# EAGLE design MP3 Shield (EAGLE 6.5.0)
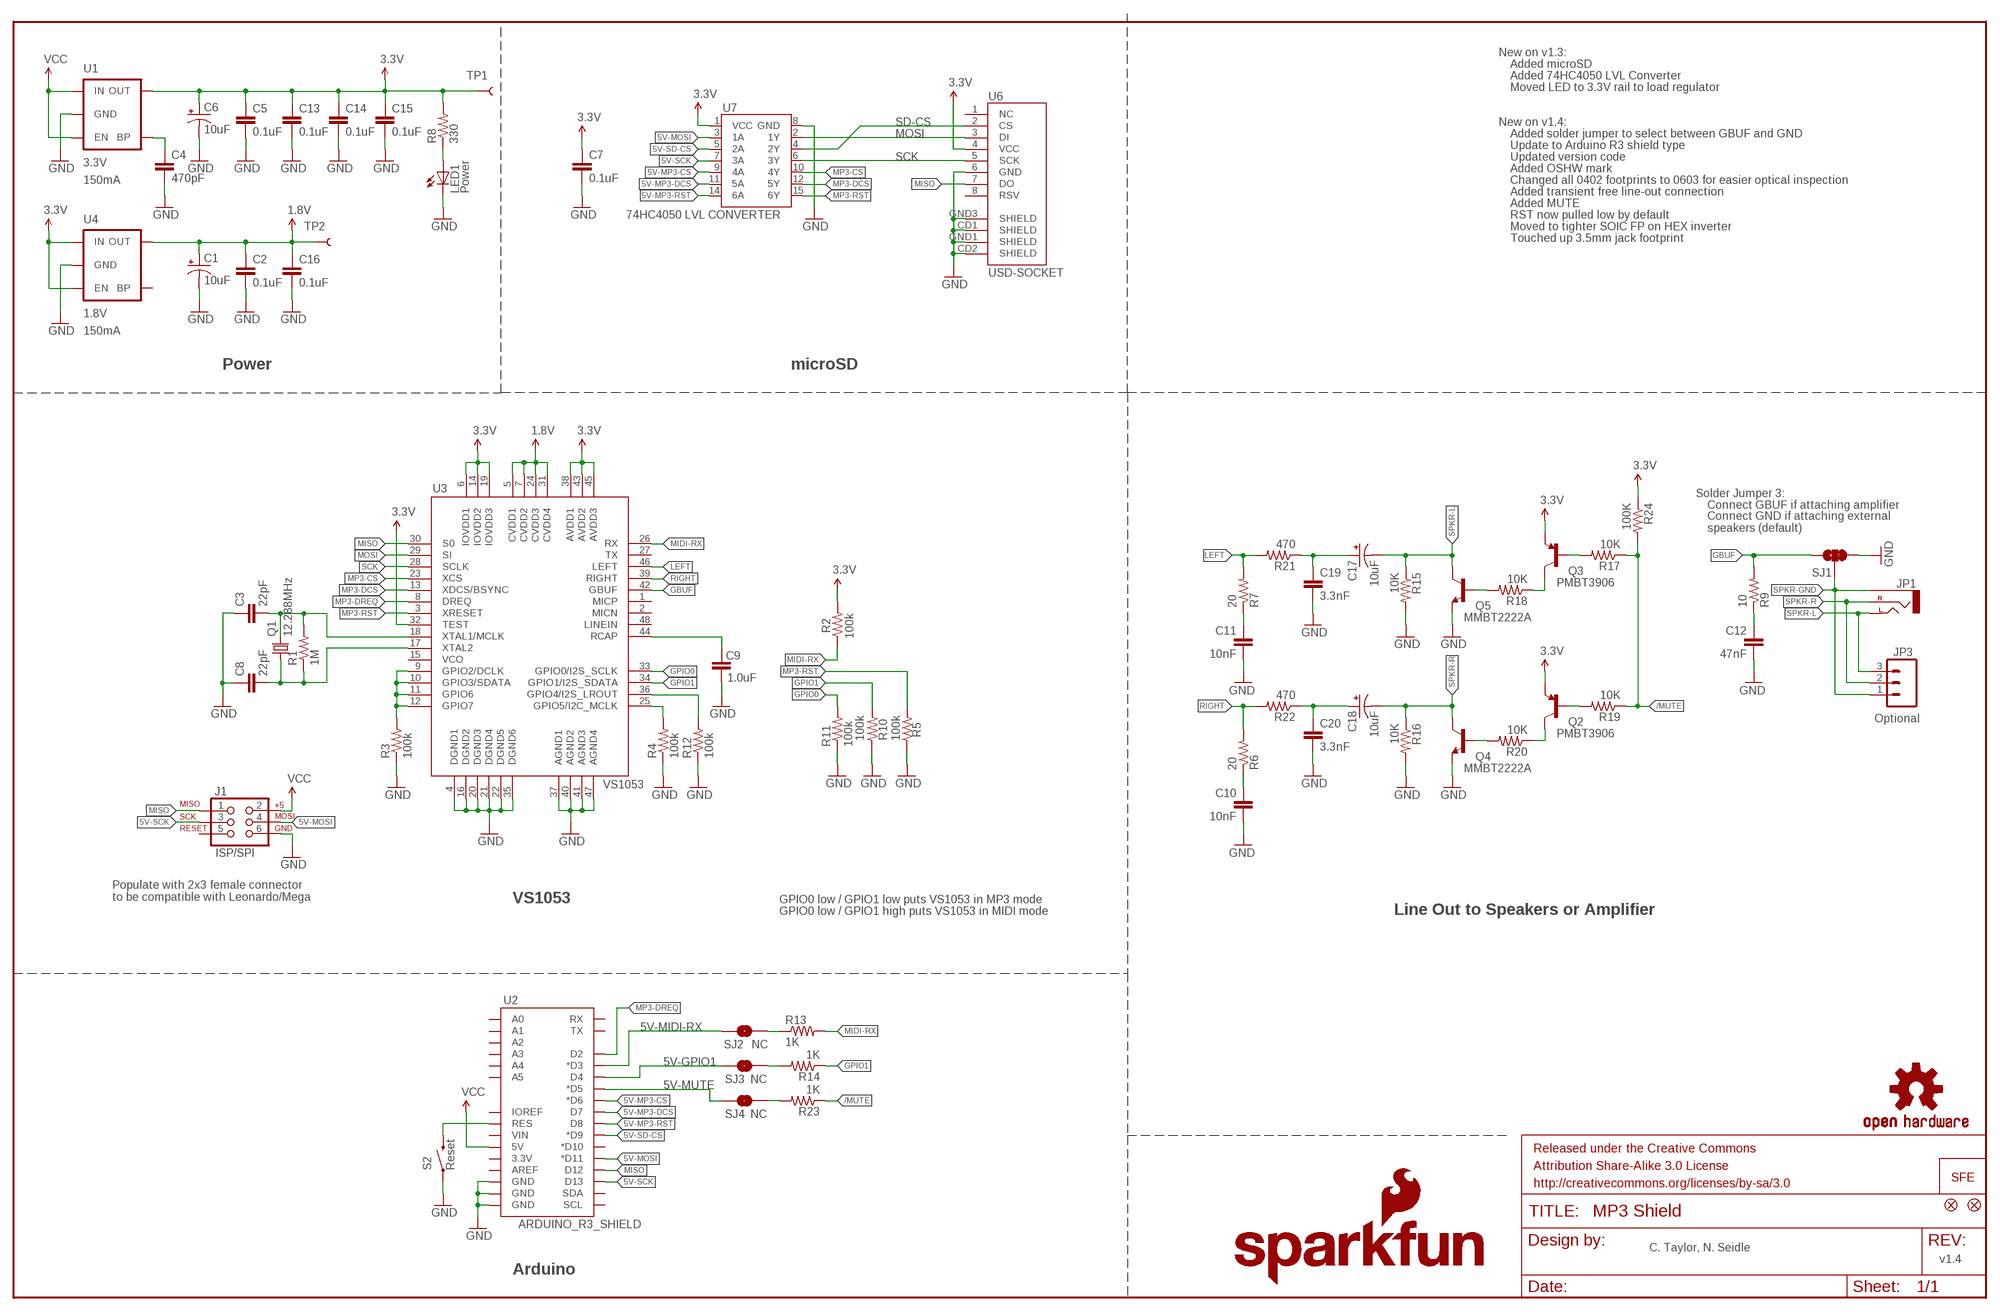
[diagram p0: schematic, sheet 1]

## Parts
C1  10uF  10UF-16V-10%(TANT)  [EIA3216]
C2  0.1uF  0.1UF-25V(+80/-20%)(0603)  [0603-CAP]
C3  22pF  22PF-50V-5%(0603)  [0603-CAP]
C4  470pF  470PF-50V-5%(0603)SMD  [0603-CAP]
C5  0.1uF  0.1UF-25V(+80/-20%)(0603)  [0603-CAP]
C6  10uF  10UF-16V-10%(TANT)  [EIA3216]
C7  0.1uF  0.1UF-25V(+80/-20%)(0603)  [0603-CAP]
C8  22pF  22PF-50V-5%(0603)  [0603-CAP]
C9  1.0uF  1.0UF-16V-10%(0603)  [0603-CAP]
C10  10nF  10NF/10000PF-50V-10%(0603)  [0603-CAP]
C11  10nF  10NF/10000PF-50V-10%(0603)  [0603-CAP]
C12  47nF  47NF(0.047UF/47000PF)-25V-5%(0603)SMD  [0603-CAP]
C13  0.1uF  0.1UF-25V(+80/-20%)(0603)  [0603-CAP]
C14  0.1uF  0.1UF-25V(+80/-20%)(0603)  [0603-CAP]
C15  0.1uF  0.1UF-25V(+80/-20%)(0603)  [0603-CAP]
C16  0.1uF  0.1UF-25V(+80/-20%)(0603)  [0603-CAP]
C17  10uF  10UF-16V-10%(TANT)  [EIA3216]
C18  10uF  10UF-16V-10%(TANT)  [EIA3216]
C19  3.3nF  3.3NF-100V-10%(0603)  [0603-CAP]
C20  3.3nF  3.3NF-100V-10%(0603)  [0603-CAP]
FRAME1  FRAME-LEDGER  [CREATIVE_COMMONS]
J1  ISP/SPI  AVR_SPI_PRG_6PTH  [2X3]
JP1  AUDIO-JACKSMD2  [AUDIO-JACK-3.5MM-SMD]
JP3  Optional  M03PTH  [1X03]
LED1  Power  LED-RED0603  [LED-0603]
LOGO1  OSHW-LOGOS  [OSHW-LOGO-S]
LOGO2  SFE_LOGO_NAME_FLAME.1_INCH  [SFE_LOGO_NAME_FLAME_.1]
Q1  12.288MHz  CRYSTAL5X3  [CRYSTAL-SMD-5X3]
Q2  PMBT3906  TRANSISTOR_PNPPMBT3906  [SOT23-3]
Q3  PMBT3906  TRANSISTOR_PNPPMBT3906  [SOT23-3]
Q4  MMBT2222A  TRANSISTOR_NPNMMBT2222A  [SOT23-3]
Q5  MMBT2222A  TRANSISTOR_NPNMMBT2222A  [SOT23-3]
R1  1M  1M-1%  [0603-RES]
R2  100k  100KOHM1/10W1%(0603)  [0603-RES]
R3  100k  100KOHM1/10W1%(0603)  [0603-RES]
R4  100k  100KOHM1/10W1%(0603)  [0603-RES]
R5  100k  100KOHM1/10W1%(0603)  [0603-RES]
R6  20  20OHM1/10W1%(0603)SMD  [0603-RES]
R7  20  20OHM1/10W1%(0603)SMD  [0603-RES]
R8  330  330OHM1/10W1%(0603)  [0603-RES]
R9  10  10OHM1/10W5%0603SMD  [0603-RES]
R10  100k  100KOHM1/10W1%(0603)  [0603-RES]
R11  100k  100KOHM1/10W1%(0603)  [0603-RES]
R12  100k  100KOHM1/10W1%(0603)  [0603-RES]
R13  1K  1KOHM1/10W1%(0603)  [0603-RES]
R14  1K  1KOHM1/10W1%(0603)  [0603-RES]
R15  10K  10KOHM1/10W1%(0603)0603  [0603-RES]
R16  10K  10KOHM1/10W1%(0603)0603  [0603-RES]
R17  10K  10KOHM1/10W1%(0603)0603  [0603-RES]
R18  10K  10KOHM1/10W1%(0603)0603  [0603-RES]
R19  10K  10KOHM1/10W1%(0603)0603  [0603-RES]
R20  10K  10KOHM1/10W1%(0603)0603  [0603-RES]
R21  470  470OHM1/10W1%(0603)  [0603-RES]
R22  470  470OHM1/10W1%(0603)  [0603-RES]
R23  1K  1KOHM1/10W1%(0603)  [0603-RES]
R24  100K  100KOHM1/10W1%(0603)  [0603-RES]
S2  Reset  SWITCH-MOMENTARY-2SMD  [TACTILE_SWITCH_SMD]
SJ1  SOLDERJUMPER_2WAYPASTE2&3  [SJ_3_PASTE2&3]
SJ2  NC  SOLDERJUMPERTRACE  [SJ_2S-TRACE]
SJ3  NC  SOLDERJUMPERTRACE  [SJ_2S-TRACE]
SJ4  NC  SOLDERJUMPERTRACE  [SJ_2S-TRACE]
TP1  TEST-POINT3X5  [PAD.03X.05]
TP2  TEST-POINT3X5  [PAD.03X.05]
U1  3.3V  V_REG_MIC52053.3V  [SOT23-5]
U2  ARDUINO_R3_SHIELD  [UNO_R3_SHIELD]
U3  VS1053  VS1033/1053SMD  [LQFP-48]
U4  1.8V  V_REG_SP62141.8V  [SC70]
U6  USD-SOCKET  USD-SOCKETNEW  [MICRO-SD-SOCKET-PP]
U7  74HC4050 LVL CONVERTER  HEX_CONVERTER  [SO016]
U$4  FIDUCIAL1X2  [FIDUCIAL-1X2]
U$5  FIDUCIAL1X2  [FIDUCIAL-1X2]
U$8  LOGO-SFENEW  [SFE-NEW-WEBLOGO]

## Nets
1.8V: C1.A(+) C2.1 C16.1 TP2.P$1 U3.5(CVDD1) U3.7(CVDD2) U3.24(CVDD3) U3.31(CVDD4) U4.5(OUT)
3.3V: C5.1 C6.A(+) C7.1 C13.1 C14.1 C15.1 Q2.2(E) Q3.2(E) R2.2 R8.2 R24.1 TP1.P$1 U1.5(OUT) U3.6(IOVDD1) U3.14(IOVDD2) U3.19(IOVDD3) U3.32(TEST) U3.38(AVDD1) U3.43(AVDD2) U3.45(AVDD3) U4.1(IN) U4.3(EN) U6.4(VCC) U7.1(VCC)
5V-GPIO1: SJ3.2 U2.D4
5V-MIDI-RX: SJ2.1 U2.D3(*D3)
5V-MOSI: J1.4 U2.D11(*D11) U7.3(1A)
5V-MP3-CS: U2.D6(*D6) U7.9(4A)
5V-MP3-DCS: U2.D7 U7.11(5A)
5V-MP3-RST: U2.D8 U7.14(6A)
5V-MUTE: SJ4.2 U2.D5(*D5)
5V-SCK: J1.3 U2.D13 U7.7(3A)
5V-SD-CS: U2.D9(*D9) U7.5(2A)
/MUTE: R17.1 R19.1 R23.1 R24.2
ARST: S2.3 U2.RES
G1: R3.2 U3.9(GPIO2/DCLK) U3.10(GPIO3/SDATA) U3.11(GPIO6) U3.12(GPIO7)
G2: R4.2 U3.25(GPIO5/I2C_MCLK)
GBUF: R9.2 SJ1.1 U3.42(GBUF)
GND: C1.C(-) C2.2 C3.1 C4.2 C5.2 C6.C(-) C7.2 C8.1 C9.1 C10.2 C11.2 C12.2 C13.2 C14.2 C15.2 C16.2 C19.2 C20.2 J1.6 LED1.C Q4.2(E) Q5.2(E) R3.1 R4.1 R5.1 R10.1 R11.1 R12.1 R15.2 R16.2 S2.1 SJ1.3 U1.2(GND) U2.GND@0(GND) U2.GND@1(GND) U2.GND@2(GND) U3.4(DGND1) U3.16(DGND2) U3.20(DGND3) U3.21(DGND4) U3.22(DGND5) U3.35(DGND6) U3.37(AGND1) U3.40(AGND2) U3.41(AGND3) U3.47(AGND4) U4.2(GND) U6.6(GND) U6.CD1(SHIELD) U6.CD2(SHIELD) U6.GND1(SHIELD) U6.GND3(SHIELD) U7.8(GND)
GPIO0: R11.2 U3.33(GPIO0/I2S_SCLK)
GPIO1: R10.2 R14.1 U3.34(GPIO1/I2S_SDATA)
GPIO4: R12.2 U3.36(GPIO4/I2S_LROUT)
LEFT: R7.2 R21.2 U3.46(LEFT)
MIDI-RX: R2.1 R13.2 U3.26(RX)
MISO: J1.1 U2.D12 U3.30(S0) U6.7(DO)
MOSI: U3.29(SI) U6.3(DI) U7.2(1Y)
MP3-CS: U3.23(XCS) U7.10(4Y)
MP3-DCS: U3.13(XDCS/BSYNC) U7.12(5Y)
MP3-DREQ: U2.D2 U3.8(DREQ)
MP3-RST: R5.2 U3.3(XRESET) U7.15(6Y)
N$1: Q4.1(B) R20.2
N$2: C12.1 R9.1
N$3: C10.1 R6.1
N$4: R14.2 SJ3.1
N$5: C11.1 R7.1
N$6: LED1.A R8.1
N$7: Q2.3(C) R20.1
N$8: R13.1 SJ2.2
N$9: C3.2 Q1.3 R1.2 U3.18(XTAL1/MCLK)
N$10: C8.2 Q1.1 R1.1 U3.17(XTAL2)
N$11: Q2.1(B) R19.2
N$12: Q5.1(B) R18.2
N$14: R23.2 SJ4.1
N$15: Q3.3(C) R18.1
N$16: Q3.1(B) R17.2
N$17: C18.A(+) C20.1 R22.1
N$19: C17.A(+) C19.1 R21.1
N$70: C4.1 U1.4(BP)
RCAP: C9.2 U3.44(RCAP)
RIGHT: R6.2 R22.2 U3.39(RIGHT)
SCK: U3.28(SCLK) U6.5(SCK) U7.6(3Y)
SD-CS: U6.2(CS) U7.4(2Y)
SPKR-GND: JP1.SLEEVE JP3.1 SJ1.2
SPKR-L: C17.C(-) JP1.TIP(LEFT) JP3.3 Q5.3(C) R15.1
SPKR-R: C18.C(-) JP1.RING(RIGHT) JP3.2 Q4.3(C) R16.1
VCC: J1.2 U1.1(IN) U1.3(EN) U2.5V
Unconnected: J1.5 U2.3.3V U2.A0 U2.A1 U2.A2 U2.A3 U2.A4 U2.A5 U2.AREF U2.D10(*D10) U2.IOREF U2.RX U2.SCL U2.SDA U2.TX U2.VIN U3.1(MICP) U3.2(MICN) U3.15(VCO) U3.27(TX) U3.48(LINEIN) U4.4(BP) U6.1(NC) U6.8(RSV)

## Notes on the sheet
- New on v1.3:
- Added microSD
- Added 74HC4050 LVL Converter
- Moved LED to 3.3V rail to load regulator
- New on v1.4:
- Added solder jumper to select between GBUF and GND
- Update to Arduino R3 shield type
- Updated version code
- Added OSHW mark
- 150mA | Changed all 0402 footprints to 0603 for easier optical inspection
- Added transient free line-out connection
- Added MUTE
- RST now pulled low by default
- Moved to tighter SOIC FP on HEX inverter
- Touched up 3.5mm jack footprint
- 150mA
- Power | microSD
- Solder Jumper 3:
- Connect GBUF if attaching amplifier
- Connect GND if attaching external
  speakers (default)
- Populate with 2x3 female connector 
  to be compatible with Leonardo/Mega
- VS1053 | GPIO0 low / GPIO1 low puts VS1053 in MP3 mode
- GPIO0 low / GPIO1 high puts VS1053 in MIDI mode | Line Out to Speakers or Amplifier
- C. Taylor, N. Seidle
- v1.4
- Arduino

## Library data of the parts
C1 C6 C17 C18 = SparkFun-Capacitors:10UF-16V-10%(TANT): CAP-00811 1206/EIA-3216 Tantalum capacitor; PROD_ID: CAP-00811
C2 C5 C7 C13-C16 = SparkFun-Capacitors:0.1UF-25V(+80/-20%)(0603): CAP-00810 Ceramic Standard decoupling cap; PROD_ID: CAP-00810
C3 C8 = SparkFun-Capacitors:22PF-50V-5%(0603): CAP-07876; PROD_ID: CAP-07876
C4 = SparkFun-Capacitors:470PF-50V-5%(0603): CAP-07884; PROD_ID: CAP-07884
C9 = SparkFun-Capacitors:1.0UF-16V-10%(0603): CAP-00868; PROD_ID: CAP-00868
C10 C11 = SparkFun-Capacitors:10NF/10000PF-50V-10%(0603): CAP-00867; PROD_ID: CAP-00867
C12 = SparkFun-Capacitors:47NF(0.047UF/47000PF)-25V-5%(0603): CAP-08605; PROD_ID: CAP-08605
C19 C20 = SparkFun-Capacitors:3.3NF-100V-10%(0603): CAP-09633; PROD_ID: CAP-09633
FRAME1 = SparkFun-Aesthetics:FRAME-LEDGER: Schematic Frame Standard 11x14 US Ledger frame
J1 = SparkFun:AVR_SPI_PRG_6: AVR ISP 6 Pin This is the reduced ISP connector for AVR programming. Common on Arduino. This footprint will take up less PCB space and can be used with a 10-pin to 6-pin adapter such as SKU: BOB-08508
JP1 = SparkFun-Connectors:AUDIO-JACK: 3.5mm Audio Jack Simple 3.5mm common PCB mount audio jack. SKU: PRT-08032; PROD_ID: CONN-10353
JP3 = SparkFun:M03: Header 3 Standard 3-pin 0.1" header. Use with straight break away headers (SKU : PRT-00116), right angle break away headers (PRT-00553), swiss pins (PRT-00743), machine pins (PRT-00117), and female headers (PRT-00115). Molex polarized connector foot print use with SKU : PRT-08232 with associated crimp pins and housings.
LED1 = SparkFun-LED:LED-RED: Assorted Red LEDs LilyPad 1206- DIO-09912 1206- DIO-00809 0603- DIO-00819; PROD_ID: DIO-00819; VALUE: RED
LOGO1 = SparkFun-Aesthetics:OSHW-LOGO: Open Source Hardware Logo This logo indicates the piece of hardware it is found on incorporates a OSHW license and/or adheres to the definition of open source hardware found here: http://freedomdefined.org/OSHW
LOGO2 = SparkFun-Aesthetics:SFE_LOGO_NAME_FLAME: SFE Logo, name and flame This is the SparkFun full logo. The logo on the schematic will always be the same size; the package variant is the height of the flame part of the logo. Default layer for the logo on the board is tSilk.
Q1 = SparkFun:CRYSTAL: Crystals Various standard crystals. Proven footprints. Spark Fun Electronics SKU : COM-00534
Q2 Q3 = SparkFun-DiscreteSemi:TRANSISTOR_PNP: Generic PNP BJT Double check pinouts against datasheets- not all devices are the same! MMBT3906 - 40V 200mA SOT-23 (TRANS-08052) MMBT4403 - 40V 600mA SOT-23 (TRANS-09245); PROD_ID: TRANS-08052
Q4 Q5 = SparkFun-DiscreteSemi:TRANSISTOR_NPN: Generic NPN BJT MMBT2222A - TRANS-08049 (SOT-23, 1A 40V) MPSA42 - TRANS-09116 (SOT-23, 500mA 300V) MMBT5088LT1G - TRANS-11160 (SOT-23, 50 mA 30V); PROD_ID: TRANS-08049
R1 = SparkFun-Resistors:1M-1%: 1M-ohm SMT 1/10W - 1% (0603) RES-07868; PROD_ID: RES-07868
R2-R5 R10-R12 = SparkFun-Resistors:100KOHM1/10W1%(0603): RES-07828; PROD_ID: RES-07828
R6 R7 = SparkFun-Resistors:20OHM1/10W1%(0603): RES-07862; PROD_ID: RES-07862
R8 = SparkFun-Resistors:330OHM1/10W1%(0603): RES-00818; PROD_ID: RES-00818
R9 = SparkFun-Resistors:10OHM1/10W5%0603: RES-09834; PROD_ID: RES-09834
R13 R14 R23 = SparkFun-Resistors:1KOHM1/10W1%(0603): RES-07856; PROD_ID: RES-07856
R15-R20 = SparkFun-Resistors:10KOHM1/10W1%(0603): RES-00824; PROD_ID: RES-00824
R21 R22 = SparkFun-Resistors:470OHM1/10W1%(0603): RES-07869; PROD_ID: RES-07869
R24 = SparkFun-Resistors:100KOHM1/10W1%(0603): RES-07828; PROD_ID: RES-07828; VALUE: 100k
S2 = SparkFun-Electromechanical:SWITCH-MOMENTARY-2: Various NO switches- pushbuttons, reed, etc; PROD_ID: SWCH-08247
SJ1 = SparkFun-Passives:SOLDERJUMPER_2WAY: Solder Jumper 2 way solder jumper
SJ2-SJ4 = SparkFun:SOLDERJUMPER: Solder Jumper Standard SMD solder jumper. Used to automate production. Two varients : Normally Open and Normally Closed are the same, but have different paste layers. NC will have a large amount of paste and should jumper during reflow.
TP1 TP2 = SparkFun:TEST-POINT
U1 = SparkFun-PowerIC:V_REG_MIC5205: V_REG MIC5219 Standard 3.3V and 5V 150mA LDO voltage regulator in SOT-23 layout. Micrel part MIC5205. BP (by-pass) pin is used to lower output noise with 470pF cap, may be left open.; PROD_ID: VREG-00822; VALUE: 3.3V/150mA
U2 = SparkFun-Boards:ARDUINO_R3_SHIELD: Shield form compatible with the Arduino Uno R3.
U3 = SparkFun-DigitalIC:VS1033/1053: MP3 codec; PROD_ID: IC-08983; VALUE: VS1053B
U4 = SparkFun-PowerIC:V_REG_SP6214; PROD_ID: VREG-08428; VALUE: 1.8V/100mA
U6 = SparkFun:USD-SOCKET: microSD Socket Push-push type uSD socket. Schematic element and footprint production proven. Spark Fun Electronics SKU : PRT-00127. tDoc lines correctly indicate media card edge positions when inserting (unlocked, locked, depressed).
U7 = SparkFun-DigitalIC:HEX_CONVERTER: Just what it says.
U$4 U$5 = SparkFun:FIDUCIAL: Fiducial Alignment Points Various fiducial points for machine vision alignment.
U$8 = SparkFun:LOGO-SFE: Spark Fun Electronics PCB Logo This is the standard Spark Fun Electronics PCB logo.

## Board
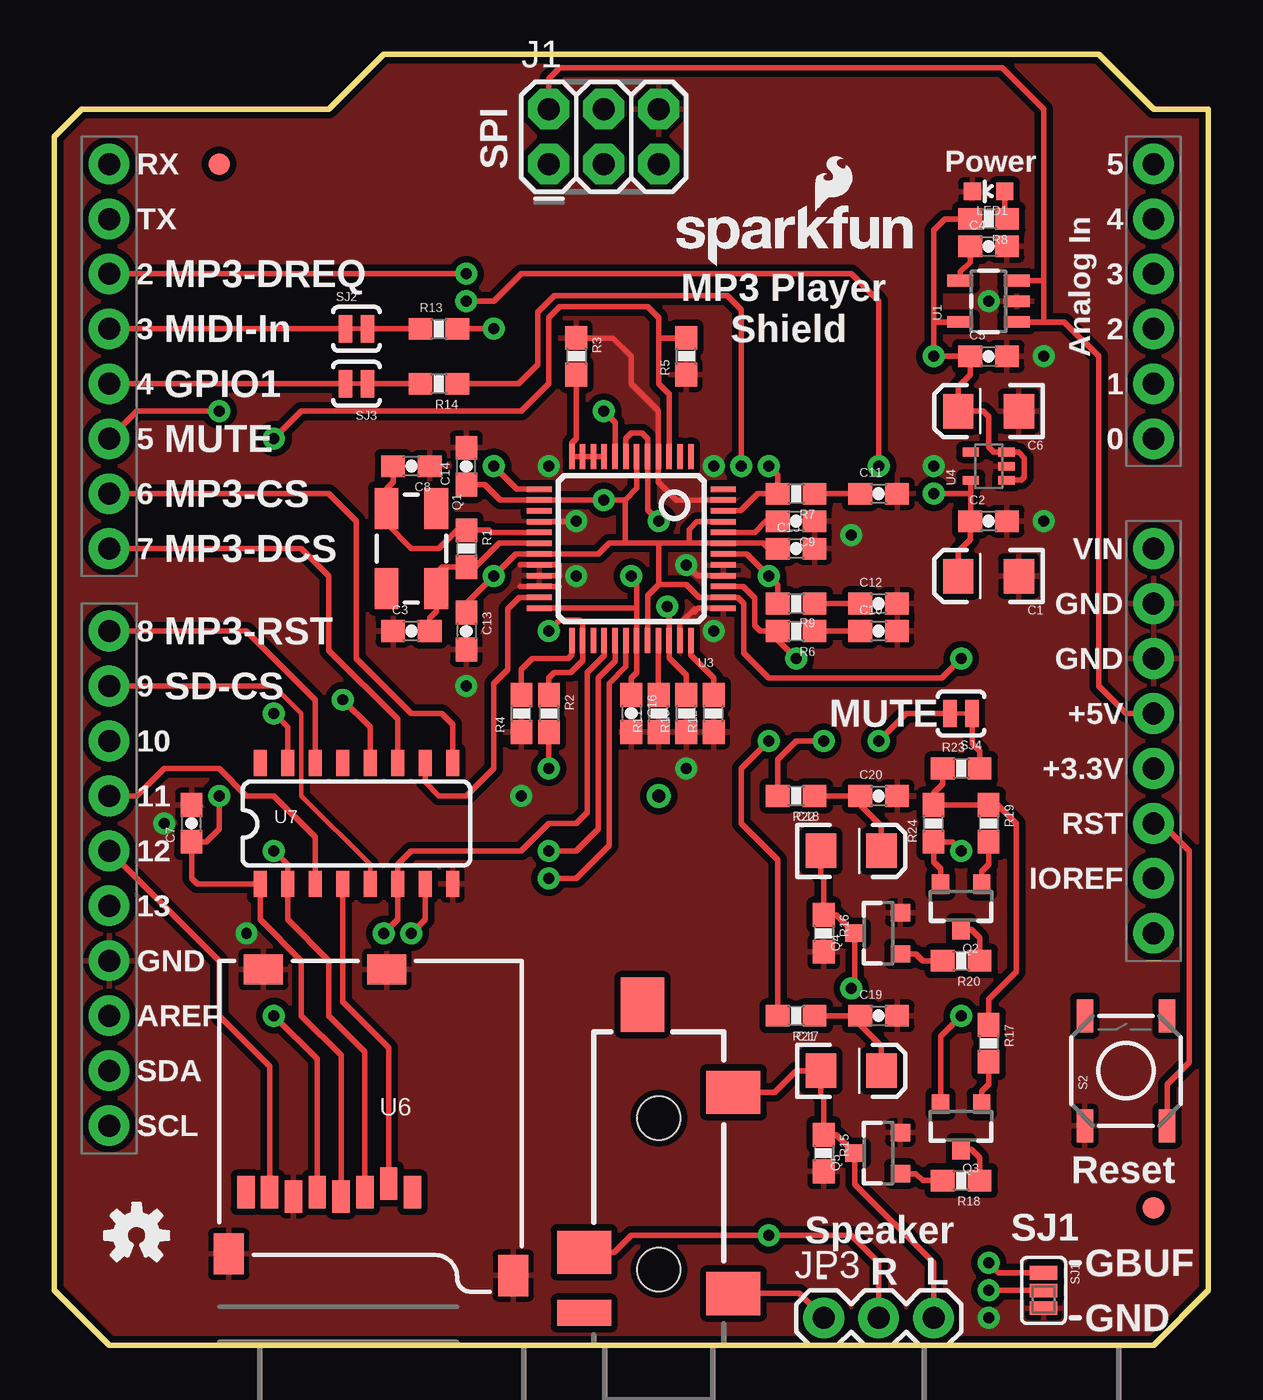
[diagram p1: board, top side]
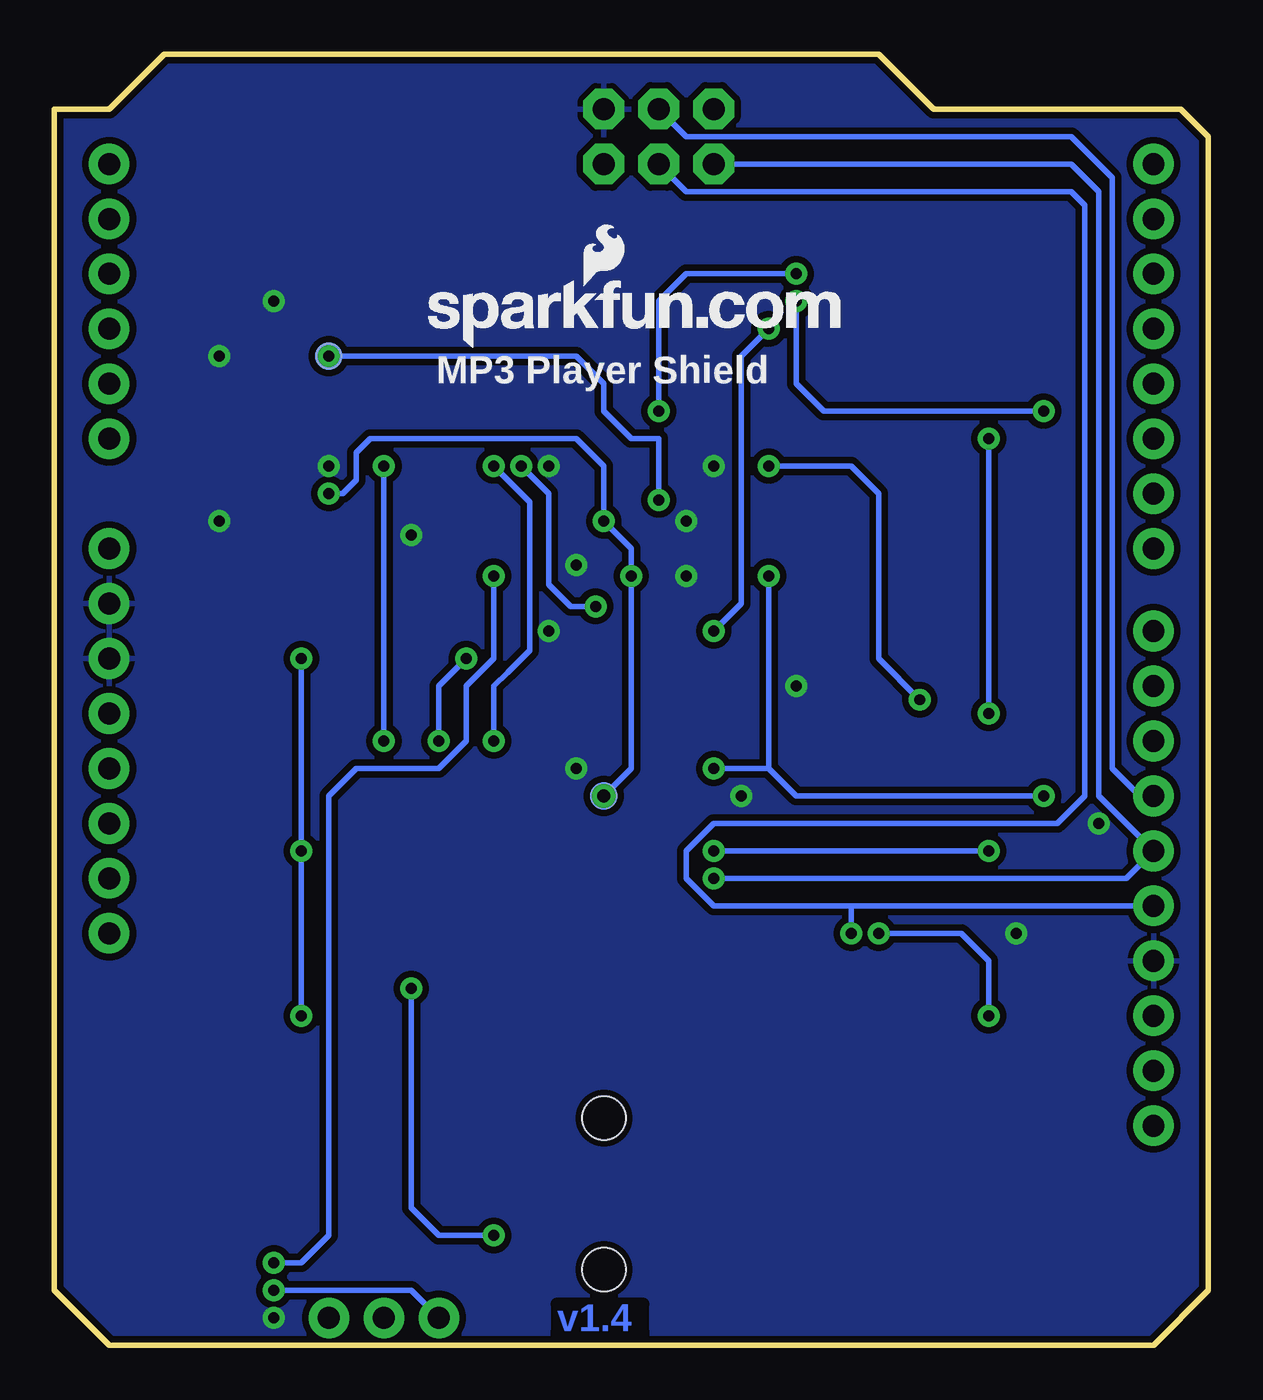
[diagram p2: board, bottom side, seen from below]

Size 53.34 x 59.69 mm. Coordinates in mm from the lower left corner, seen from the top.
Outline: 2.54,0 0,2.54 0,55.88 1.27,57.15 12.7,57.15 15.24,59.69 48.26,59.69 50.8,57.15 53.34,57.15 53.34,2.54 50.8,0 2.54,0
Copper layers (1*16): Top 0.035mm / dielectric 1.5mm / Bottom 0.035mm
Design rules "SparkFun *": minimum track width 8mil, minimum drill 20mil, track to track 8mil, track to pad 8mil, pad to pad 8mil, via to via 8mil, smd to smd 8mil, copper to edge 10mil, drill to drill 8mil, minimum pad ring 12mil, minimum via ring 10mil, stop-mask expansion 4mil, vias tented up to drill 20mil, thermal gap 10mil

### Footprints (pad centres in the part's own frame; a part is rotated, then mirrored left to right if it is on the bottom)
EIA3216 = smd 1.4 x 1.6: A 1.4,0; C -1.4,0
0603-CAP = smd 1.1 x 1: 1 -0.85,0; 2 0.85,0
2X3 = drill 1.016 pad 1.88 octagon: 1 0,0; 2 0,2.54; 3 2.54,0; 4 2.54,2.54; 5 5.08,0; 6 5.08,2.54
AUDIO-JACK-3.5MM-SMD = smd 2 x 2.5: RING 4.3,3.45; SLEEVE 2.4,-3.45; TIP 11.7,-3.45 | smd 1.2 x 2.5: RSH 1.5,3.45 | smd 2.5 x 2: TSH 15.75,0.75 | hole 2: 3.5,0; 10.5,0
1X03 = drill 1.016 pad 1.88: 1 0,0; 2 2.54,0; 3 5.08,0
LED-0603 = smd 0.8 x 0.8: A 0,-0.75; C 0,0.75
CRYSTAL-SMD-5X3 = smd 1.9 x 1.1: 1 -1.85,-1.15; 2 1.85,-1.15; 3 1.85,1.15; 4 -1.85,1.15
SOT23-3 = smd 0.8 x 0.9: 1 -0.95,-1; 2 0.95,-1; 3 0,1.1
0603-RES = smd 1.1 x 1: 1 -0.85,0; 2 0.85,0
TACTILE_SWITCH_SMD = smd 1.524 x 0.762: 1 -2.54,1.905; 2 2.54,1.905; 3 -2.54,-1.905; 4 2.54,-1.905
SJ_3_PASTE2&3 = smd 0.635 x 1.27: 1 -0.813,0; 2 0,0; 3 0.813,0
SJ_2S-TRACE = smd 0.635 x 1.27: 1 -0.508,0; 2 0.508,0
PAD.03X.05 = smd 1.27 x 1.27: P$1 0,0
SOT23-5 = smd 0.55 x 1.2: 1 -0.95,-1.3; 2 0,-1.3; 3 0.95,-1.3; 4 0.95,1.3; 5 -0.95,1.3
UNO_R3_SHIELD = drill 1.016 pad 1.88: 3.3V 50.8,26.67; 5V 50.8,29.21; A0 50.8,41.91; A1 50.8,44.45; A2 50.8,46.99; A3 50.8,49.53; A4 50.8,52.07; A5 50.8,54.61; AREF 2.54,15.24; D2 2.54,49.53; D3 2.54,46.99; D4 2.54,44.45; D5 2.54,41.91; D6 2.54,39.37; D7 2.54,36.83; D8 2.54,33.02; D9 2.54,30.48; D10 2.54,27.94; D11 2.54,25.4; D12 2.54,22.86; D13 2.54,20.32; GND@0 50.8,31.75; GND@1 50.8,34.29; GND@2 2.54,17.78; IOREF 50.8,21.59; NC 50.8,19.05; RES 50.8,24.13; RX 2.54,54.61; SCL 2.54,10.16; SDA 2.54,12.7; TX 2.54,52.07; VIN 50.8,36.83
LQFP-48 = smd 0.254 x 1.143: 1 -2.75,-4.25; 2 -2.25,-4.25; 3 -1.75,-4.25; 4 -1.25,-4.25; 5 -0.75,-4.25; 6 -0.25,-4.25; 7 0.25,-4.25; 8 0.75,-4.25; 9 1.25,-4.25; 10 1.75,-4.25; 11 2.25,-4.25; 12 2.75,-4.25; 25 2.75,4.25; 26 2.25,4.25; 27 1.75,4.25; 28 1.25,4.25; 29 0.75,4.25; 30 0.25,4.25; 31 -0.25,4.25; 32 -0.75,4.25; 33 -1.25,4.25; 34 -1.75,4.25; 35 -2.25,4.25; 36 -2.75,4.25 | smd 1.143 x 0.254: 13 4.25,-2.75; 14 4.25,-2.25; 15 4.25,-1.75; 16 4.25,-1.25; 17 4.25,-0.75; 18 4.25,-0.25; 19 4.25,0.25; 20 4.25,0.75; 21 4.25,1.25; 22 4.25,1.75; 23 4.25,2.25; 24 4.25,2.75; 37 -4.25,2.75; 38 -4.25,2.25; 39 -4.25,1.75; 40 -4.25,1.25; 41 -4.25,0.75; 42 -4.25,0.25; 43 -4.25,-0.25; 44 -4.25,-0.75; 45 -4.25,-1.25; 46 -4.25,-1.75; 47 -4.25,-2.25; 48 -4.25,-2.75
SC70 = smd 0.4 x 0.75: 1 -0.65,-0.825; 2 0,-0.825; 3 0.65,-0.825; 4 0.65,0.825; 5 -0.65,0.825
MICRO-SD-SOCKET-PP = smd 0.8 x 1.5: 1 -8.94,10.7; 2 -7.84,10.3; 3 -6.74,10.7; 4 -5.64,10.9; 5 -4.54,10.7; 6 -3.44,10.9; 7 -2.34,10.7; 8 -1.24,10.7 | smd 1.8 x 1.4: CD1 -2.05,0.4; CD2 -7.75,0.4 | smd 1.4 x 1.9: GND1 -13.6,14.55; GND3 -0.45,13.55
SO016 = smd 0.6 x 1.2: 1 -4.445,-2.8; 2 -3.175,-2.8; 3 -1.905,-2.8; 4 -0.635,-2.8; 5 0.635,-2.8; 6 1.905,-2.8; 7 3.175,-2.8; 8 4.445,-2.8; 9 4.445,2.8; 10 3.175,2.8; 11 1.905,2.8; 12 0.635,2.8; 13 -0.635,2.8; 14 -1.905,2.8; 15 -3.175,2.8; 16 -4.445,2.8
FIDUCIAL-1X2 = smd 1 x 1: 1 0,0

### Placement (x,y rotation side)
C1  43.18,35.56 180 top
C2  43.18,38.1 0 top
C3  16.51,33.02 0 top
C4  43.18,50.8 0 top
C5  43.18,45.72 0 top
C6  43.18,43.18 180 top
C7  6.35,24.13 90 top
C8  16.51,40.64 180 top
C9  34.29,38.1 180 top
C10  38.1,33.02 0 top
C11  38.1,39.37 0 top
C12  38.1,34.29 0 top
C13  19.05,33.02 270 top
C14  19.05,40.64 90 top
C15  34.29,36.83 0 top
C16  26.67,29.21 270 top
C17  36.83,12.7 0 top
C18  36.83,22.86 0 top
C19  38.1,15.24 0 top
C20  38.1,25.4 0 top
FRAME1  -19.05,-24.13 0 top  (outside the outline)
J1  22.86,54.61 0 top
JP1  27.94,0 90 top
JP3  35.56,1.27 0 top
LED1  43.18,53.34 90 top
LOGO1  3.81,5.08 0 top
LOGO2  28.32,49.78 0 top
Q1  16.51,36.83 270 top
Q2  41.91,20.32 180 top
Q3  41.91,10.16 180 top
Q4  38.1,19.05 90 top
Q5  38.1,8.89 90 top
R1  19.05,36.83 270 top
R2  22.86,29.21 270 top
R3  24.13,45.72 270 top
R4  21.59,29.21 90 top
R5  29.21,45.72 90 top
R6  34.29,33.02 180 top
R7  34.29,39.37 180 top
R8  43.18,52.07 180 top
R9  34.29,34.29 180 top
R10  29.21,29.21 90 top
R11  27.94,29.21 90 top
R12  30.48,29.21 90 top
R13  17.78,46.99 0 top
R14  17.78,44.45 180 top
R15  35.56,8.89 270 top
R16  35.56,19.05 270 top
R17  43.18,13.97 270 top
R18  41.91,7.62 180 top
R19  43.18,24.13 270 top
R20  41.91,17.78 180 top
R21  34.29,15.24 180 top
R22  34.29,25.4 180 top
R23  41.91,26.67 0 top
R24  40.64,24.13 90 top
S2  49.53,12.7 90 top
SJ1  45.72,2.54 270 top
SJ2  13.97,46.99 0 top
SJ3  13.97,44.45 180 top
SJ4  41.91,29.21 180 top
TP1  40.64,45.72 0 bottom
TP2  27.94,25.4 0 bottom
U1  43.18,48.26 90 top
U2  0,0 0 top
U3  26.67,36.83 180 top
U4  43.18,40.64 90 top
U6  7.62,17.78 180 top
U7  13.97,24.13 0 top
U$4  7.62,54.61 0 top
U$5  50.8,6.35 0 top
U$8  36.07,46.1 0 bottom

### Tracks (layer width: path | path; a pad name or v marks a point on that pad's centre or on a via)
1.8V  (via drill 0.51, 0.6)
  Top 0.254: 26.92,34.04 U3.31 26.92,31.11 26.67,30.86 C16.1 | 26.92,34.04 26.92,35.31 v26.67,35.56 | U3.24 26.88,34.08 26.92,34.04 | v27.94,38.1 27.42,38.62 U3.5 27.42,41.92 27.18,42.16 26.67,42.16 26.42,41.91 U3.7 | C1.A 41.78,36.7 42.33,37.25 C2.1 42.35,38.12 42.35,39.37 | U4.5 42.35,39.37 | 42.35,39.37 v40.64,39.37
  Bottom 0.254: TP2.P$1 26.67,26.67 v26.67,35.56 26.67,36.83 v27.94,38.1 27.94,40.64 29.21,41.91 38.73,41.91 39.37,41.27 39.37,40.01 40.01,39.37 v40.64,39.37
  other vias: 27.94,25.4
3.3V  (via drill 0.51)
  Top 0.254: 26.42,37.08 25.65,37.08 25.15,36.58 U3.19 21.34,36.58 v20.32,35.56 19.05,34.29 C13.1 | 26.42,37.08 27.94,37.08 | 27.94,37.08 29.34,37.08 | 29.34,37.08 U3.43 32.77,37.08 33.02,36.83 C15.1 | U3.45 29.7,38.08 29.34,37.72 29.34,37.08 | 26.42,37.08 26.38,37.12 26.38,39.08 | 26.38,39.08 v25.4,39.08 U3.14 20.61,39.08 19.9,39.79 C14.1 | U3.32 27.42,34.66 27.94,35.18 | 27.94,37.08 27.94,35.18 | U3.6 26.92,39.62 26.38,39.08 | U4.1 44.69,39.99 44.83,40.13 44.83,41.02 44.56,41.29 U4.3 43.42,41.29 43.18,41.53 43.18,42.93 42.93,43.18 C6.A 41.78,44.32 42.33,44.87 C5.1 TP1.P$1 40.64,47.37 | U6.4 13.26,13.41 11.43,15.24 11.43,17.78 9.53,19.68 U7.1 6.61,21.33 6.35,21.59 C7.1 7.02,23.28 7.62,23.88 v7.62,25.4 | U1.5 40.7,47.31 40.64,47.37 | 40.64,47.37 40.64,51.56 41.15,52.07 R8.2 | Q2.2 40.96,22.03 40.64,22.35 R24.1 41.49,23.28 v41.91,22.86 | Q3.2 40.96,14.29 v41.91,15.24 | R2.2 v22.86,26.67 | 27.94,35.18 29.21,35.18 29.81,34.58 U3.38 31.59,34.58 31.88,34.29 31.88,32 33.02,30.86 41.02,30.86 v41.91,31.75
  Bottom 0.254: 20.32,26.67 v20.32,35.56 | 20.32,26.67 v22.86,26.67 | v41.91,15.24 v41.91,22.86 v41.91,31.75 | TP1.P$1 29.21,45.72 27.94,44.45 27.94,43.18 26.67,41.91 25.4,41.91 v25.4,39.08 | v7.62,25.4 19.05,25.4 20.32,26.67
  other vias: 40.64,45.72
5V-GPIO1
  Top 0.254: SJ3.2 U2.D4
5V-MIDI-RX
  Top 0.254: SJ2.1 U2.D3
5V-MOSI
  Top 0.254: U7.3 12.06,23.5 10.16,25.4 8.89,25.4 7.62,26.67 5.08,26.67 3.81,25.4 U2.D11
  Bottom 0.254: U2.D11 3.17,25.4 4.45,26.67 4.45,53.98 6.35,55.88 24.13,55.88 J1.4
5V-MP3-CS
  Top 0.254: U2.D6 12.7,39.37 13.97,38.1 13.97,31.75 16.51,29.21 17.91,29.21 18.41,28.7 U7.9
5V-MP3-DCS
  Top 0.254: U7.11 15.88,28.96 12.7,32.13 12.7,35.56 11.43,36.83 U2.D7
5V-MP3-RST
  Top 0.254: U7.14 12.06,29.84 8.89,33.02 U2.D8
5V-MUTE  (via drill 0.51)
  Top 0.254: v19.05,48.26 20.32,48.26 21.59,49.53 36.83,49.53 38.1,48.26 v38.1,40.64 | U2.D5 3.81,43.18 v7.62,43.18 | v38.1,27.94 39.37,29.21 SJ4.2
  Bottom 0.254: v19.05,48.26 19.05,44.45 17.78,43.18 v7.62,43.18 | v38.1,40.64 v38.1,27.94
5V-SCK  (via drill 0.51)
  Top 0.254: U7.7 17.14,19.68 v16.51,19.05
  Bottom 0.254: 3.81,20.32 U2.D13 16.51,20.32 | 16.51,20.32 22.86,20.32 24.13,21.59 24.13,22.86 22.86,24.13 6.99,24.13 5.71,25.4 5.71,52.7 6.35,53.34 24.13,53.34 J1.3 | v16.51,19.05 16.51,20.32
5V-SD-CS
  Top 0.203: 10.16,30.48 11.43,29.21 11.43,25.4 14.61,22.23 U7.5
  Top 0.254: 10.16,30.48 U2.D9
/MUTE
  Top 0.254: R17.1 43.18,16 44.45,17.27 44.45,24.13 43.6,24.98 R19.1 R24.2 40.64,25.53 41.06,25.95 R23.1
ARST
  Top 0.254: U2.RES 51.18,24.13 52.45,22.86 52.45,13.08 51.44,12.06 S2.3
G1
  Top 0.254: U3.9 U3.10 U3.11 U3.12 23.92,41.7 24.13,41.91 R3.2
G2
  Top 0.254: U3.25 23.92,31.92 23.75,31.75 22.1,31.75 21.59,31.24 R4.2
GBUF  (via drill 0.51)
  Top 0.254: SJ1.1 43.64,3.35 v43.18,3.81 | R9.2 33.44,35.14 v33.02,35.56 32,36.58 U3.42
  Bottom 0.254: v33.02,35.56 33.02,31.75 34.29,30.48 34.29,27.94 35.56,26.67 39.37,26.67 40.64,25.4 40.64,5.08 41.91,3.81 v43.18,3.81
GND  (via drill 0.51)
  Top 0.254: U3.47 28.74,39.08 27.92,39.9 U3.4 27.92,43.2 26.67,44.45 26.67,45.72 25.82,46.57 R3.1 | U3.16 24.11,38.08 v24.13,38.1 | U3.21 23.35,35.58 | 23.35,35.58 23.37,35.56 | 21.53,36.09 23.35,36.09 23.35,35.58 | 21.53,35.07 23.35,35.07 | U3.40 29.72,35.58 29.23,36.07 v29.21,36.07 | U3.35 28.92,33.37 29.59,34.04 | U3.37 29.76,34.08 29.59,33.91
  other vias: 30.48,33.02 24.13,35.56 40.64,40.64 29.21,26.67 30.48,40.64 36.83,37.47 22.86,40.64 45.72,45.72 45.72,38.1 43.18,48.26 5.08,24.13 43.18,1.27 8.89,19.05 21.59,25.4 19.05,30.48
  pour Top (isolate 0.305): 0,59.69 53.34,59.69 53.34,0 0,0
  pour Bottom (isolate 0.305): 0,0 0,59.69 53.34,59.69 53.34,0
GPIO0
  Top 0.254: U3.33 27.92,30.08 R11.2
GPIO1  (via drill 0.51)
  Top 0.254: R14.1 21.46,44.45 22.35,45.34 22.35,47.75 23.11,48.51 31.11,48.51 31.75,47.88 v31.75,40.64 | v28.32,34.16 28.42,34.06 U3.34 28.42,31.78 29.21,30.99 R10.2
  Bottom 0.254: v31.75,40.64 30.48,39.37 30.48,35.18 29.46,34.16 v28.32,34.16
GPIO4
  Top 0.254: U3.36 29.42,31.92 30.48,30.86 R12.2
LEFT  (via drill 0.51)
  Top 0.254: R21.2 33.44,22.44 31.75,24.13 31.75,26.67 v33.02,27.94 | v33.02,40.64 33.44,40.22 R7.2 32.51,39.37 31.72,38.58 U3.46
  Bottom 0.254: v33.02,27.94 33.02,30.48 32.38,31.11 32.13,31.37 31.37,32.13 31.37,38.99 v33.02,40.64
MIDI-RX  (via drill 0.51)
  Top 0.254: R13.2 v20.32,46.99 | v22.86,33.02 23.37,33.53 24.26,33.53 24.42,33.37 U3.26 24.42,31.66 23.88,31.11 23.11,31.11 22.86,30.86 R2.1
  Bottom 0.254: v20.32,46.99 21.59,45.72 21.59,34.29 v22.86,33.02
MISO  (via drill 0.51)
  Top 0.254: U3.30 26.42,31.37 25.65,30.61 25.65,23.11 24.13,21.59 v22.86,21.59 | U6.7 9.96,12.9 7.62,15.24 7.62,17.78 U2.D12
  Bottom 0.254: v22.86,21.59 3.81,21.59 U2.D12 5.08,25.4 5.08,53.34 6.35,54.61 J1.1
MOSI  (via drill 0.51)
  Top 0.254: v10.16,22.86 10.79,22.23 U7.2 10.79,19.68 12.7,17.78 12.7,15.24 14.36,13.58 U6.3 | U3.29 25.92,31.64 25.15,30.86 25.15,23.88 24.13,22.86 v22.86,22.86
  Bottom 0.254: v22.86,22.86 v10.16,22.86
MP3-CS
  Top 0.254: U3.23 21.5,34.58 20.95,34.04 20.95,31.24 20.32,30.61 20.32,26.67 19.05,25.4 17.78,25.4 17.14,26.04 U7.10
MP3-DCS  (via drill 0.51)
  Top 0.254: U3.13 21.38,39.58 v20.32,40.64 | U7.12 14.61,28.57 v13.34,29.84
  Bottom 0.254: v20.32,40.64 16.51,40.64 15.24,39.37 15.24,31.75 v13.34,29.84
MP3-DREQ  (via drill 0.51)
  Top 0.254: U3.8 25.92,42.66 v25.4,43.18 | U2.D2 v19.05,49.53
  Bottom 0.254: v25.4,43.18 25.4,48.26 24.13,49.53 v19.05,49.53
MP3-RST  (via drill 0.51)
  Top 0.254: U7.15 10.79,28.57 v10.16,29.21 | v10.16,41.91 11.43,43.18 21.59,43.18 22.86,44.45 22.86,47.5 23.37,48.01 27.43,48.01 27.94,47.5 27.94,46.61 | U3.3 28.42,43.97 27.94,44.45 27.94,46.61 | R5.2 27.98,46.57 27.94,46.61
  Bottom 0.254: v10.16,29.21 v10.16,41.91
N$1
  Top 0.254: Q4.1 39.81,18.1 40.13,17.78 R20.2
N$2
  Top 0.254: R9.1 C12.1
N$3
  Top 0.254: R6.1 C10.1
N$4
  Top 0.254: R14.2 SJ3.1
N$5
  Top 0.254: R7.1 C11.1
N$6
  Top 0.254: LED1.A 43.93,52.17 R8.1
N$7
  Top 0.254: Q2.3 42.38,19.22 42.76,18.84 R20.1
N$8
  Top 0.254: R13.1 SJ2.2
N$9
  Top 0.254: C3.2 17.36,33.62 17.66,33.92 Q1.3 17.66,35.69 17.95,35.98 R1.2 19.47,35.98 20.57,37.08 U3.18
N$10
  Top 0.254: C8.2 15.66,39.92 15.36,39.62 Q1.1 15.36,37.98 16.51,36.83 17.78,36.83 18.63,37.68 R1.1 20.11,37.68 20.2,37.58 U3.17
N$11
  Top 0.254: Q2.1 42.86,21.91 43.18,22.23 R19.2
N$12
  Top 0.254: Q5.1 39.81,7.94 40.13,7.62 R18.2
N$14
  Top 0.254: SJ4.1 42.42,27.81 42.76,27.47 R23.2
N$15
  Top 0.254: Q3.3 42.38,9.06 42.76,8.68 R18.1
N$16
  Top 0.254: Q3.1 42.86,11.74 43.18,12.06 R17.2
N$17
  Top 0.254: R22.1 C20.1 37.25,24.98 38.23,24 C18.A
N$19
  Top 0.254: C17.A 38.23,13.84 37.25,14.82 C19.1 R21.1
N$70
  Top 0.254: C4.1 42.33,50.08 41.88,49.63 U1.4
RCAP
  Top 0.254: U3.44 32.37,37.58 32.89,38.1 C9.2
RIGHT  (via drill 0.51)
  Top 0.254: 35.31,27.94 v35.56,27.94 34.29,27.94 33.44,27.09 R22.2 | U3.39 31.85,35.08 32.38,34.54 32.38,33.27 32.64,33.02 R6.2 33.44,32.6 v34.29,31.75
  Bottom 0.254: v34.29,31.75 35.56,30.48 v35.56,27.94
SCK  (via drill 0.51)
  Top 0.254: v15.24,19.05 15.88,19.68 U7.6 15.88,22.23 16.51,22.86 21.59,22.86 22.86,24.13 24.13,24.13 24.64,24.64 24.64,31.11 25.42,31.9 U3.28 | U6.5 12.16,13.24 v10.16,15.24
  Bottom 0.254: v15.24,19.05 11.43,19.05 10.16,17.78 v10.16,15.24
SD-CS
  Top 0.254: U7.4 13.34,15.88 15.46,13.75 U6.2
SPKR-GND  (via drill 0.51)
  Top 0.254: SJ1.2 v43.18,2.54 | JP1.SLEEVE 34.43,2.4 JP3.1
  Bottom 0.254: JP3.1 36.83,2.54 v43.18,2.54
SPKR-L
  Top 0.254: JP3.3 40.64,3.81 37,7.45 Q5.3 36.15,9.74 R15.1 35.56,11.43 35.43,11.56 C17.C 34.29,12.7 33.29,11.7 JP1.TIP
SPKR-R  (via drill 0.51)
  Top 0.254: JP1.RING 25.89,4.3 26.67,5.08 v33.02,5.08 36.83,5.08 38.1,3.81 JP3.2 | C18.C 35.43,21.72 35.56,21.59 R16.1 36.15,19.9 Q4.3 37,16.68 v36.83,16.51
  Bottom 0.254: v36.83,16.51 36.83,6.35 35.56,5.08 v33.02,5.08
VCC
  Top 0.254: U1.1 45.72,47.31 | 45.72,47.31 46.67,47.31 48.26,45.72 48.26,30.48 49.53,29.21 U2.5V | J1.2 22.86,58.55 23.37,59.05 43.81,59.05 45.72,57.15 45.72,49.28 | 45.72,49.28 45.72,47.31 | U1.3 45.65,49.21 45.72,49.28

### Text on the board
Bottom: v1.4
tPlace: SPI | Power | MP3-DREQ | MP3 Player | MIDI-In | Shield | GPIO1 | MUTE | MP3-CS | MP3-DCS | MP3-RST | SD-CS | MUTE | Reset | Speaker | SJ1 | - | R | L | GBUF | GND | C. Taylor, N. Seidle
bPlace: MP3 Player Shield